# EAGLE schematic IMDDC (EAGLE 9.1.3)
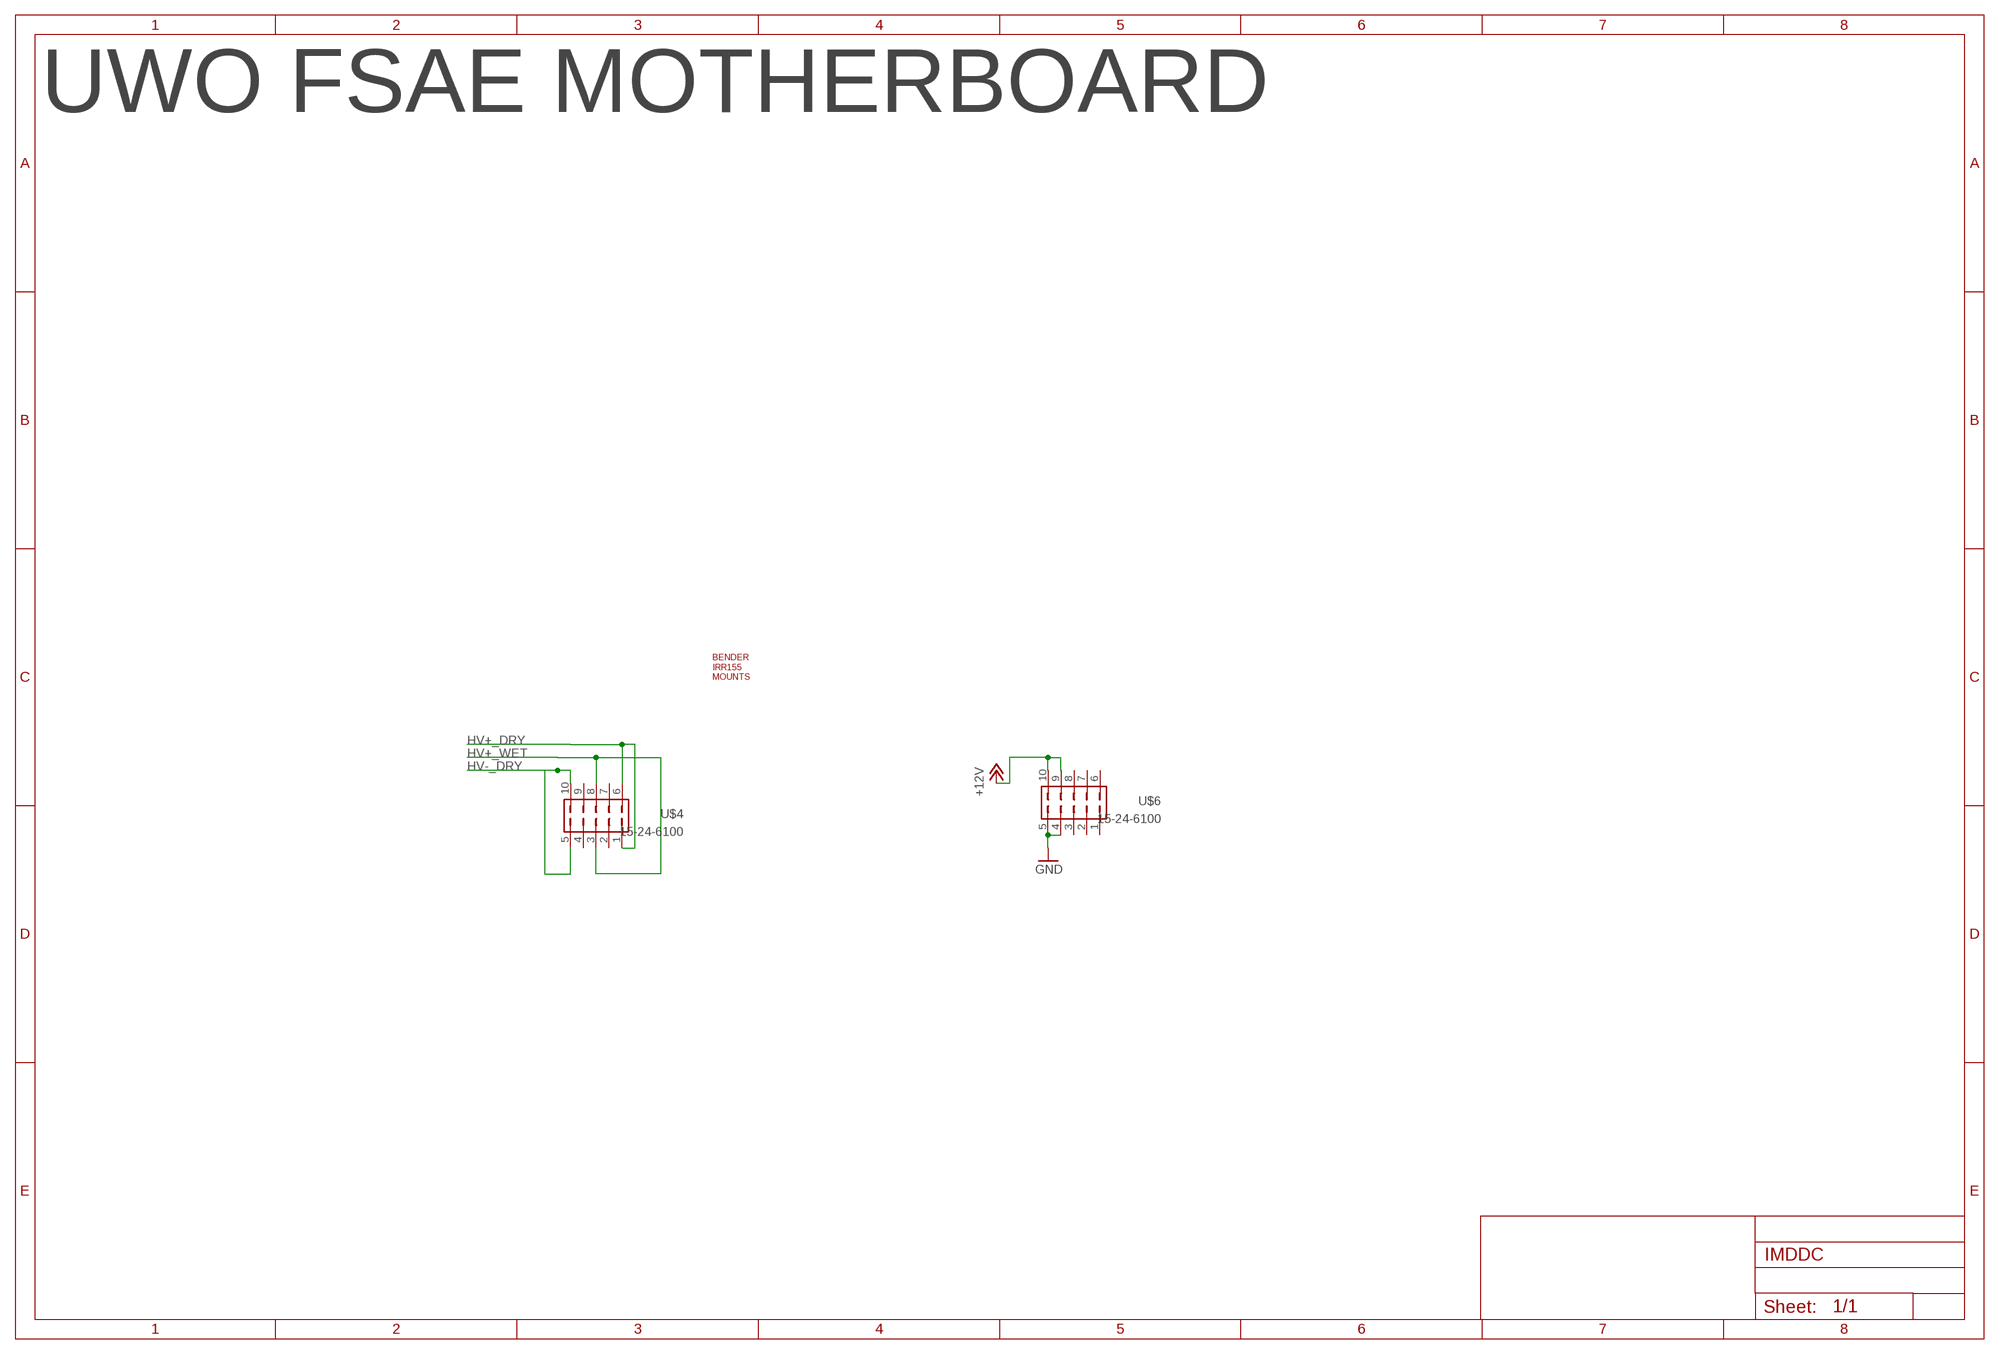
[diagram p0: schematic, sheet 1]

## Parts
U$1  BENDER_IRR155  [BENDER_IRR155]
U$4  15-24-6100  [15-24-6100]
U$6  15-24-6100  [15-24-6100]

## Nets
+12V: U$6.9 U$6.10
GND: U$6.4 U$6.5
HV+_DRY [HV]: U$4.1 U$4.6
HV+_WET [HV]: U$4.3 U$4.8
HV-_DRY [HV]: U$4.5 U$4.10
Unconnected: U$4.2 U$4.4 U$4.7 U$4.9 U$6.1 U$6.2 U$6.3 U$6.6 U$6.7 U$6.8

## Notes on the sheet
- UWO FSAE MOTHERBOARD

## Library data of the parts
U$1 = ACC-MB-R0:BENDER_IRR155
U$4 U$6 = ACC-MB-R0:15-24-6100

## Net classes
0 default: width 1 mm, clearance 0.152 mm
1 LV: clearance 0.001 mm
2 HV: clearance 2.5 mm